# Altium schematic sheet llrf_afe_mfm.SchDoc: =GlobalProjectName
size 209 x 297 mm; SheetNumber: 3; SheetTotal: 17; PageSetup: Record=PageOptions|CenterHorizontal=True|CenterVertical=True|PrintScale=1.00|XCorrection=1.00|YCorrection=1.00|PrintKind=1|BorderSize=5000000|LeftOffset=0|BottomOffset=0|Orientation=2|PaperLength=1000|PaperWidth=1000|Scale=100|PaperSource=15|PrintQuality=1200|MediaType=1|DitherType=10|PaperKind=A3|PrintScaleMode=1; Weight: -; ScaleFactor: -
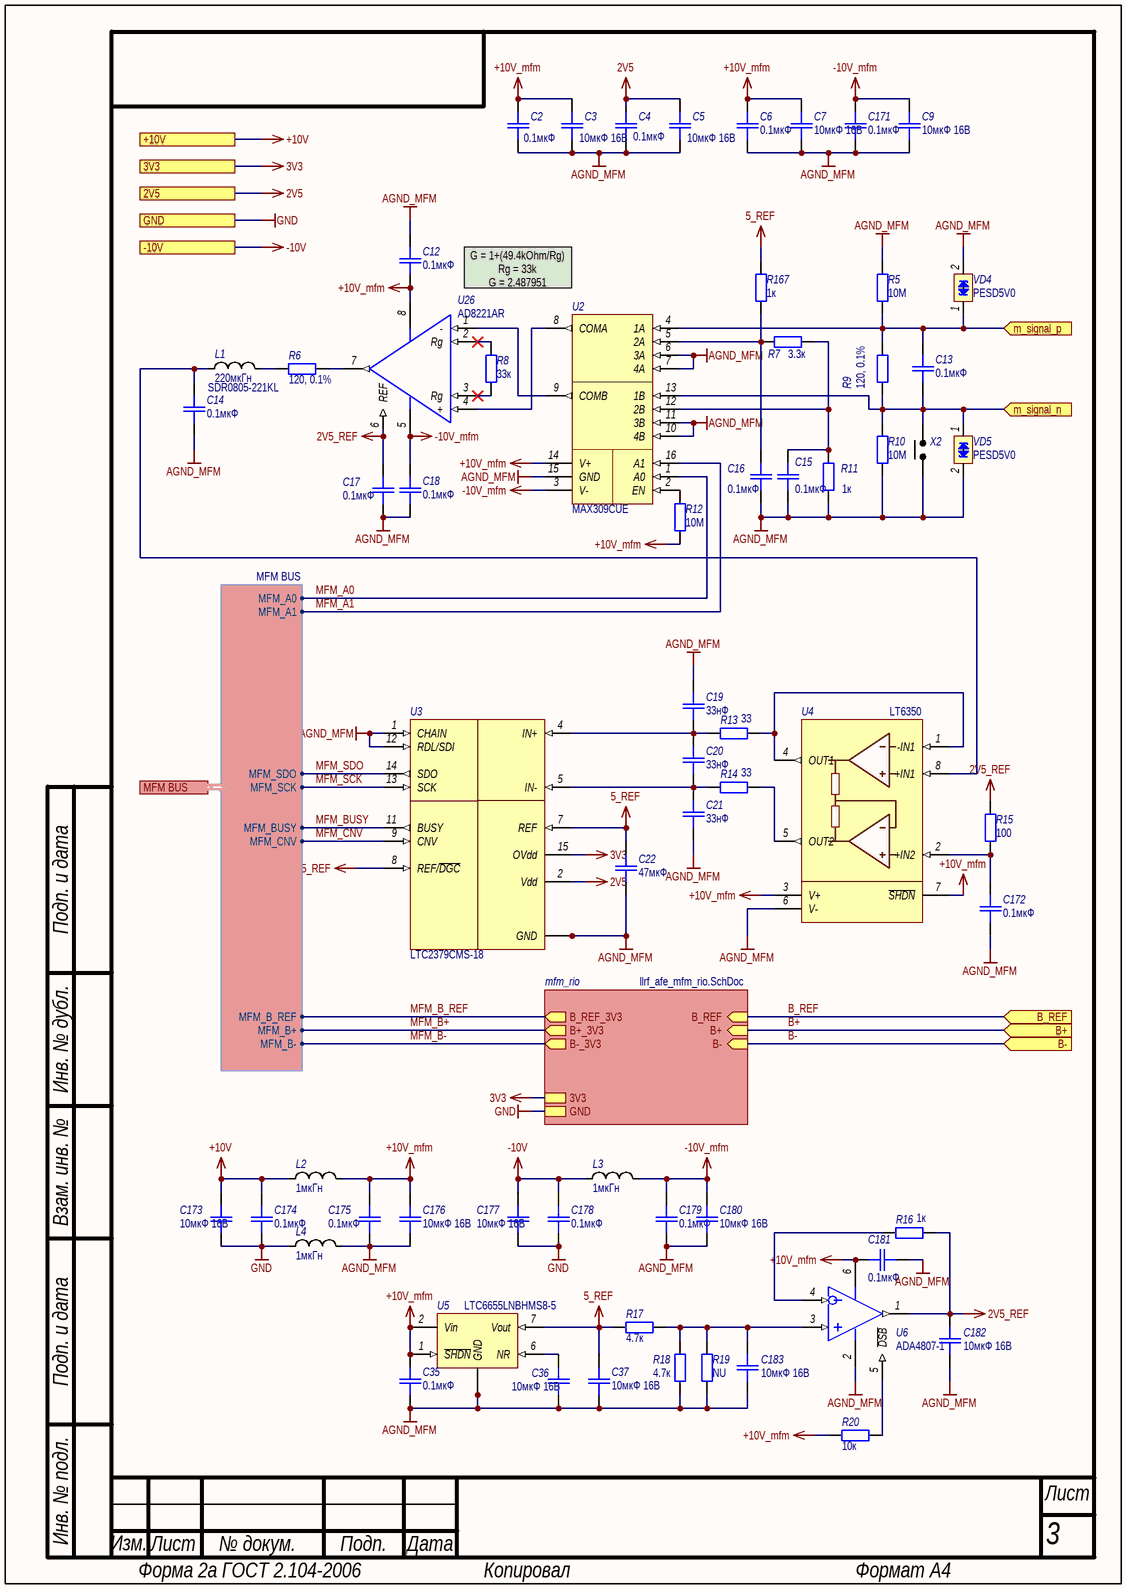
[diagram p0: llrf_afe_mfm.SchDoc]

## Parts
C2  0.1мкФ  [SMD_C0402]
C3  10мкФ 16В  [SMD_C0603]
C4  0.1мкФ  [SMD_C0402]
C5  10мкФ 16В  [SMD_C0603]
C6  0.1мкФ  [SMD_C0402]
C7  10мкФ 16В  [SMD_C0603]
C9  10мкФ 16В  [SMD_C0603]
C12  0.1мкФ  [SMD_C0402]
C13  0.1мкФ  [SMD_C0402]
C14  0.1мкФ  [SMD_C0603]
C15  0.1мкФ  [SMD_C0402]
C16  0.1мкФ  [SMD_C0402]
C17  0.1мкФ  [SMD_C0402]
C18  0.1мкФ  [SMD_C0402]
C19  33нФ  [SMD_C0603]
C20  33нФ  [SMD_C0603]
C21  33нФ  [SMD_C0603]
C22  47мкФ  [SMD_C0805]
C35  0.1мкФ  [SMD_C0402]
C36  10мкФ 16В  [SMD_C0603]
C37  10мкФ 16В  [SMD_C0603]
C171  0.1мкФ  [SMD_C0402]
C172  0.1мкФ  [SMD_C0402]
C173  10мкФ 16В  [SMD_C0603]
C174  0.1мкФ  [SMD_C0402]
C175  0.1мкФ  [SMD_C0402]
C176  10мкФ 16В  [SMD_C0603]
C177  10мкФ 16В  [SMD_C0603]
C178  0.1мкФ  [SMD_C0402]
C179  0.1мкФ  [SMD_C0402]
C180  10мкФ 16В  [SMD_C0603]
C181  0.1мкФ  [SMD_C0402]
C182  10мкФ 16В  [SMD_C0603]
C183  10мкФ 16В  [SMD_C0603]
L1  220мкГн  Наименование: SDR0805-221KL  [SDR0805]
L2  1мкГн  [SMD_0805]
L3  1мкГн  [SMD_0805]
L4  1мкГн  [SMD_0805]
R5  10M  [SMD_0603]
R6  120, 0.1%  [SMD_0603]
R7  3.3к  [SMD_0603]
R8  33к  [SMD_0603]
R9  120, 0.1%  [SMD_0603]
R10  10M  [SMD_0603]
R11  1к  [SMD_0603]
R12  10M  [SMD_0603]
R13  33  [SMD_0603]
R14  33  [SMD_0603]
R15  100  [SMD_0603]
R16  1к  [SMD_0603]
R17  4.7к  [SMD_0603]
R18  4.7к  [SMD_0603]
R19  NU  [SMD_0603]
R20  10к  [SMD_0603]
R167  1к  [SMD_0603]
U2  MAX309CUE  [TSSOP-16N]
U3  Наименование: LTC2379CMS-18  [MSOP16]  (hidden comment: LTC2739)
U4  LT6350  [MSOP-8]
U5  Наименование: LTC6655LNBHMS8-5  [MSOP-8]  (hidden comment: LTC6655LN)
U6  ADA4807-1  [SOT23-6]
U26  Наименование: AD8221AR  [SOIC-8]  (hidden comment: AD8221)
VD4  PESD5V0  [SOD-323]
VD5  PESD5V0  [SOD-323]
X2  Jumper 2  [PLS-2]  (value not drawn)

## Sub-sheets
mfm_rio = llrf_afe_mfm_rio.SchDoc: 3V3, GND, B_REF_3V3 (out), B- (in), B+ (in), B_REF (in), B+_3V3 (out), B-_3V3 (out)

## Ports
2V5, 3V3, +10V, -10V, B+ (in), B- (in), B_REF (in), GND, m_signal_n (in), m_signal_p (in), MFM BUS (harness MFM BUS)

## Harnesses
MFM BUS: MFM_A0, MFM_A1, MFM_SDO, MFM_SCK, MFM_BUSY, MFM_CNV, MFM_B_REF, MFM_B+, MFM_B-

## Nets
2V5: C4.2 C5.2 U3.2(Vdd) ; port 2V5
2V5_REF: C17.2 C182.2 R15.2 R16.1 U6.1(OUT) U26.6(REF)
3V3: U3.15(OVdd) ; port 3V3, sheet mfm_rio/3V3
5_REF: C22.2 C37.2 R17.2 R167.1 U3.7(REF) U3.8(REF/~{DGC}) U5.7(Vout)
+10V: C173.2 C174.2 L2.1 ; port +10V
+10V_mfm: C2.2 C3.2 C6.2 C7.2 C12.2 C35.2 C175.2 C176.2 C181.2 L2.2 R12.1 R20.1 U2.14(V+) U4.3(V+) U4.7(~{SHDN}) U5.1(~{SHDN}) U5.2(Vin) U6.6(V+) U26.8(V+)
-10V: C177.2 C178.2 L3.1 ; port -10V
-10V_mfm: C9.2 C18.2 C171.2 C179.2 C180.2 L3.2 U2.3(V-) U26.5(V-)
AGND_MFM: C2.1 C3.1 C4.1 C5.1 C6.1 C7.1 C9.1 C12.1 C14.1 C15.1 C16.1 C17.1 C18.1 C19.2 C21.1 C22.1 C35.1 C36.1 C37.1 C171.1 C172.1 C175.1 C176.1 C179.1 C180.1 C181.1 C182.1 C183.1 L4.2 R5.2 R10.1 R11.2 R18.2 R19.2 U2.6(3A) U2.7(4A) U2.10(4B) U2.11(3B) U2.15(GND) U3.1(CHAIN) U3.3(GND) U3.6(GND) U3.10(GND) U3.12(RDL/SDI) U3.16(GND) U4.6(V-) U5.3(GND) U5.4(GND) U5.5(GND) U5.8(GND) U6.2(V-) VD4.2(cathode_2) VD5.2(cathode_2) X2.1
GND: C173.1 C174.1 C177.1 C178.1 L4.1 ; port GND, sheet mfm_rio/GND
B+: port B+, sheet mfm_rio/B+
B-: port B-, sheet mfm_rio/B-
B_REF: port B_REF, sheet mfm_rio/B_REF
m_signal_n: C13.1 R9.1 R10.2 U2.13(1B) VD5.1(cathode_1) X2.2 ; port m_signal_n
m_signal_p: C13.2 R5.1 R9.2 U2.4(1A) VD4.1(cathode_1) ; port m_signal_p
MFM_A0: U2.1(A0) ; port MFM BUS.MFM_A0
MFM_A1: U2.16(A1) ; port MFM BUS.MFM_A1
MFM_B+: sheet mfm_rio/B+_3V3, port MFM BUS.MFM_B+
MFM_B-: sheet mfm_rio/B-_3V3, port MFM BUS.MFM_B-
MFM_B_REF: sheet mfm_rio/B_REF_3V3, port MFM BUS.MFM_B_REF
MFM_BUSY: U3.11(BUSY) ; port MFM BUS.MFM_BUSY
MFM_CNV: U3.9(CNV) ; port MFM BUS.MFM_CNV
MFM_SCK: U3.13(SCK) ; port MFM BUS.MFM_SCK
MFM_SDO: U3.14(SDO) ; port MFM BUS.MFM_SDO
NetC14_2: C14.2 L1.1 U4.8(+IN1)
NetC15_2: C15.2 R7.2 R11.1 U2.12(2B)
NetC16_2: C16.2 R7.1 R167.2 U2.5(2A)
NetC19_1: C19.1 C20.2 R13.2 U3.4(IN+)
NetC20_1: C20.1 C21.2 R14.2 U3.5(IN-)
NetC36_2: C36.2 U5.6(NR)
NetC172_2: C172.2 R15.1 U4.2(+IN2)
NetC183_2: C183.2 R17.1 R18.1 R19.1 U6.3(IN+)
NetL1_2: L1.2 R6.2
NetR6_1: R6.1 U26.7(OUT)
NetR8_1: R8.1 U26.3(Rg)
NetR8_2: R8.2 U26.2(Rg)
NetR12_2: R12.2 U2.2(EN)
NetR13_1: R13.1 U4.1(-IN1) U4.4(OUT1)
NetR14_1: R14.1 U4.5(OUT2)
NetR16_2: R16.2 U6.4(IN-)
NetR20_2: R20.2 U6.5(~{DSB})
NetU2_8: U2.8(COMA) U26.4(+)
NetU2_9: U2.9(COMB) U26.1(-)

## Notes on the sheet
- G = 1+(49.4kOhm/Rg)
  Rg = 33k
  G = 2.487951
- Подп. и дата
- Инв. № дубл.
- Взам. инв. №
- Инв. № подл.
- Изм.
- Лист
- № докум.
- Подп.
- Дата
- Форма 2а ГОСТ 2.104-2006
- Копировал
- Формат А4

## Library data of the parts
C2-C7 C9 C12-C22 C35-C37 C171-C183 = Capacitor: Назначение: SMD-конденсатор; Наименование: Конденсатор; Потребление, Вт: 0
  C2 C4 C6 C12-C18 C35 C171 C172 C174 C175 C178 C179 C181: Value: 0.1мкФ
  C3 C5 C7 C9 C36 C37 C173 C176 C177 C180 C182 C183: Value: 10мкФ 16В
  C19-C21: Value: 33нФ
  C22: Value: 47мкФ
L1 = Inductor: Назначение: SMD-индуктивность; Потребление, Вт: 0,010; Value: 220мкГн
L2-L4 = Inductor: Наименование: Индуктивность; Назначение: SMD-индуктивность; Потребление, Вт: 0,010; Value: 1мкГн
R5-R20 R167 = Resistor: Наименование: Резистор; Назначение: SMD-резистор; Потребление, Вт: 0,001
  R5 R10 R12: Value: 10M
  R6 R9: Value: 120, 0.1%
  R7: Value: 3.3к
  R8: Value: 33к
  R11 R16 R167: Value: 1к
  R13 R14: Value: 33
  R15: Value: 100
  R17 R18: Value: 4.7к
  R19: Value: NU
  R20: Value: 10к
U2 = MAX309CUE: Precision, 8-Channel/Dual 4-Channel, / High-Performance, CMOS Analog Multiplexers; Назначение: Аналоговый двухканальный мультиплексор; Потребление, Вт: 0,001; Наименование: MAX309CUE; ComponentLink1Description: DataSheet; ComponentLink1URL: https://datasheets.maximintegrated.com/en/ds/MAX308-MAX309.pdf
U3 = LTC2739: 18-Bit, 1.6Msps, Low Power SAR ADC with 101.2dB SNR; Потребление, Вт: 0,025; Назначение: 18-Bit, 1.6Msps, Low Power SAR ADC with 101.2dB SNR; ComponentLink1Description: DataSheet; ComponentLink1URL: https://www.analog.com/media/en/technical-documentation/data-sheets/237918fb.pdf
U4 = LT6350: Single-Ended to Differential Converter/ADC Driver, Rail-to-Rail; Наименование: LT6350CMS8; Потребление, Вт: 0,05; Назначение: Single-Ended to Differential Converter/ADC Driver; ComponentLink1Description: DataSheet; ComponentLink1URL: https://www.analog.com/media/en/technical-documentation/data-sheets/6350fc.pdf
U5 = LTC6655LN: 0.25ppm Noise, Low Drift Precision References; Потребление, Вт: 0,005; Назначение: 0.25ppm Noise, Low Drift Precision References; ComponentLink1Description: DataSheet; ComponentLink1URL: https://www.analog.com/media/en/technical-documentation/data-sheets/ltc6655-6655ln.pdf
U6 = ADA4807-1: Rail-to-Rail Input/Output Amplifiers, 3.1 nV/√Hz, 1 mA, 180 MHz; Потребление, Вт: 0,01; Назначение: Rail-to-Rail Input/Output Amplifiers, 3.1 nV/√Hz, 1 mA, 180 MHz; ComponentLink1Description: DataSheet; ComponentLink1URL: https://www.analog.com/media/en/technical-documentation/data-sheets/ADA4807-1_4807-2_4807-4.pdf; Supplier 1: Digi-Key; Supplier Part Number 1: ADA4807-1AKSZ-R2CT-ND; Наименование: ADA4807-1
U26 = AD8221: Precision Instrumentation Amplifier; Потребление, Вт: 0.01; Назначение: Precision Instrumentation Amplifier; ComponentLink1Description: DataSheet; ComponentLink1URL: https://www.analog.com/media/en/technical-documentation/data-sheets/AD8221.pdf
VD4 VD5 = PESDxL1BA: Low capacitance bidirectional ESD protection diodes; Назначение: ESD защитные диоды; Потребление, Вт: 0.0; Наименование: PESDxL1BA; ComponentLink1Description: DataSheet; ComponentLink1URL: https://static.chipdip.ru/lib/635/DOC005635911.pdf
X2 = Jumper 2: Jumper, 2-Pin, Dual row; Потребление, Вт: 0,0; Наименование: Jumper 2-pin; Назначение: Jumper, 2-Pin, Dual row